# EAGLE schematic SCH1001-001-009-320 - ALU (EAGLE 9.4.2)

## Sheet 1 of 4
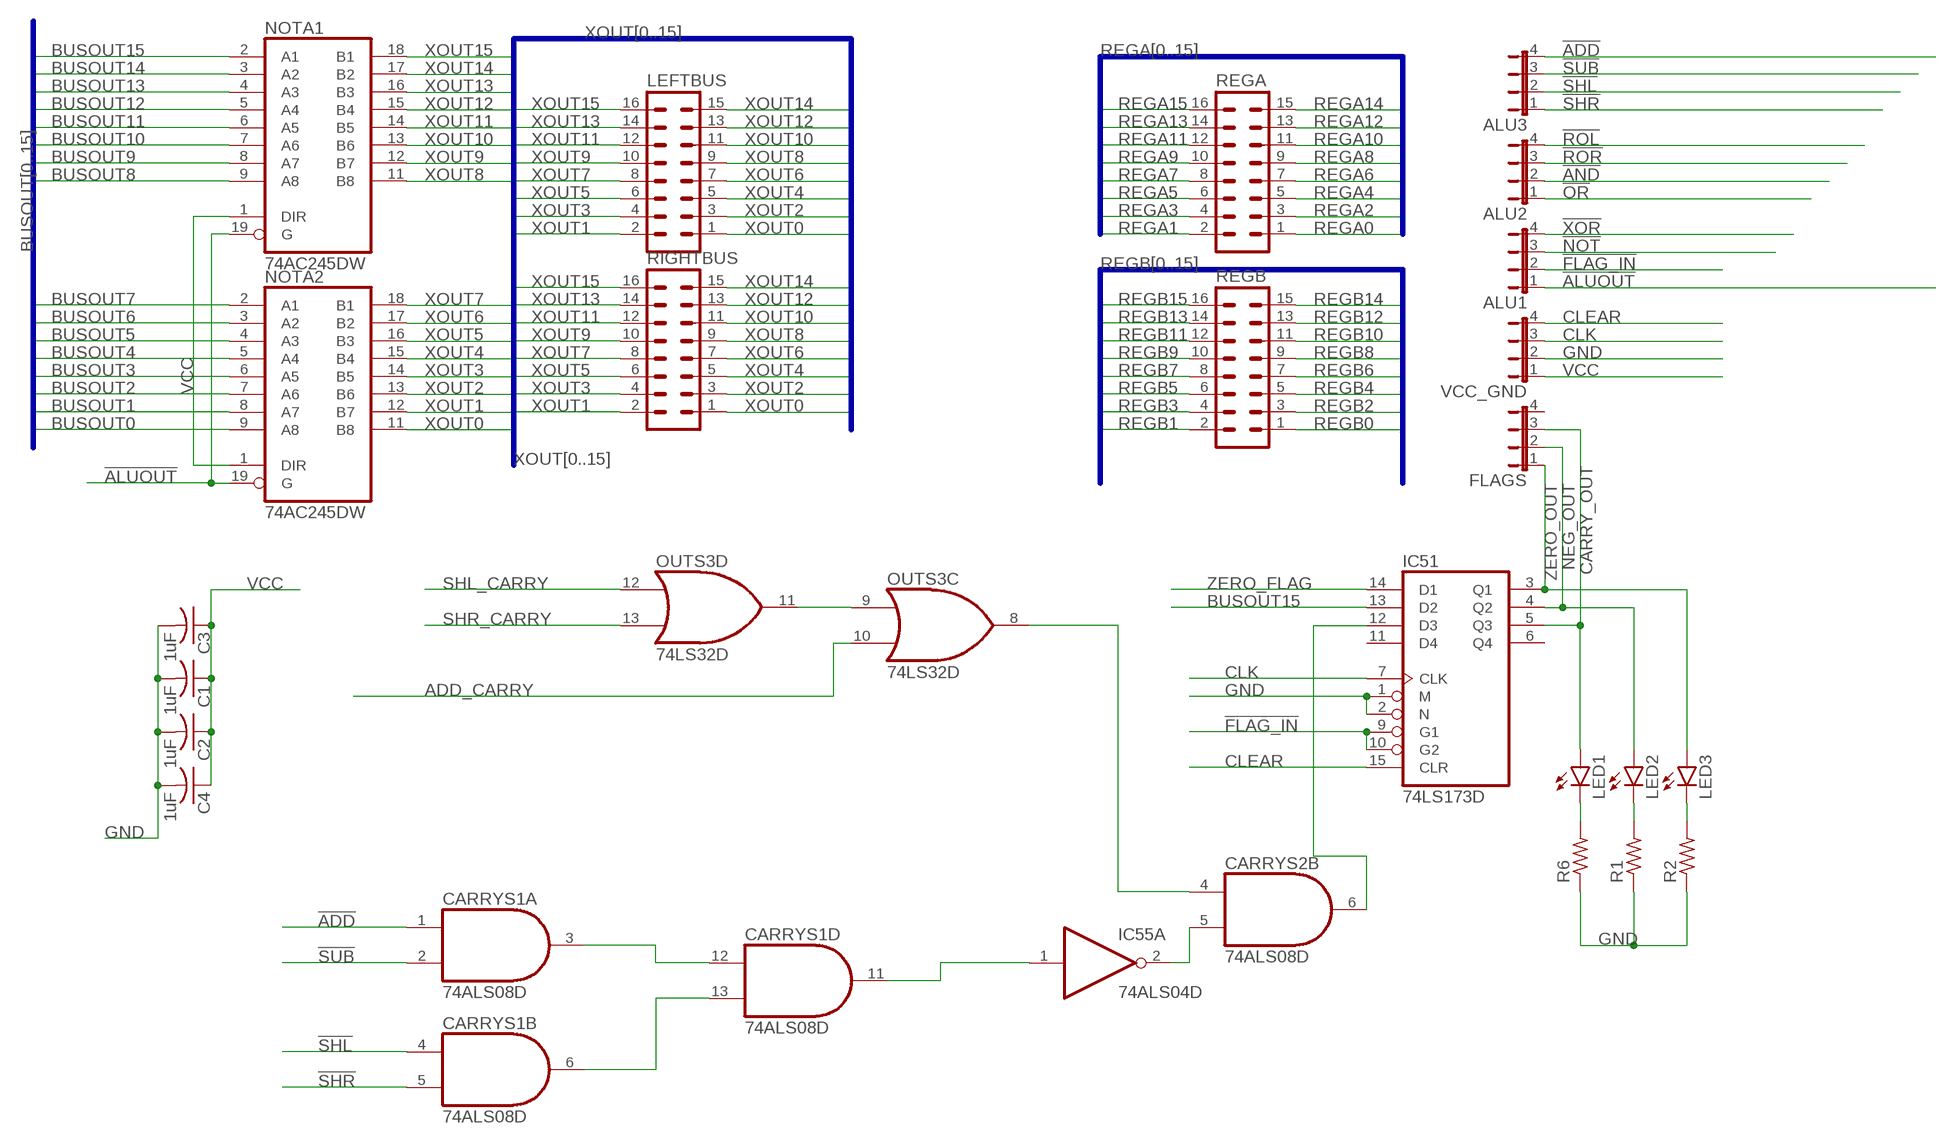
[diagram p0: schematic, sheet 1]

### Parts
ALU1  JP4E  [JP4]
ALU2  JP4E  [JP4]
ALU3  JP4E  [JP4]
C1  1uF  C-USC1206  [C1206]
C2  1uF  C-USC1206  [C1206]
C3  1uF  C-USC1206  [C1206]
C4  1uF  C-USC1206  [C1206]
CARRYS1  74ALS08D  [SO14]
CARRYS2  74ALS08D  [SO14]
FLAGS  JP4E  [JP4]
IC51  74LS173D  [SO16]
IC55  74ALS04D  [SO14]
LED1  LED5MM  [LED5MM]
LED2  LED5MM  [LED5MM]
LED3  LED5MM  [LED5MM]
LEFTBUS  ML16  [ML16]
NOTA1  74AC245DW  [SO20W]
NOTA2  74AC245DW  [SO20W]
OUTS3  74LS32D  [SO14]
R1  R-US_M1206  [M1206]
R2  R-US_M1206  [M1206]
R6  R-US_M1206  [M1206]
REGA  ML16  [ML16]
REGB  ML16  [ML16]
RIGHTBUS  ML16  [ML16]
VCC_GND  JP4E  [JP4]

### Nets
!ADD: ALU3.4 CARRYS1.1(A:I0) ; also sheet 4
!ALUOUT: ALU1.1 NOTA1.19(G) NOTA2.19(G)
!AND: ALU2.2 ; also sheet 3
!FLAG_IN: ALU1.2 IC51.9(G1) IC51.10(G2)
!NOT: ALU1.3 ; also sheet 2
!OR: ALU2.1 ; also sheet 3
!ROL: ALU2.4
!ROR: ALU2.3
!SHL: ALU3.2 CARRYS1.4(B:I0) ; also sheet 2
!SHR: ALU3.1 CARRYS1.5(B:I1) ; also sheet 2
!SUB: ALU3.3 CARRYS1.2(A:I1) ; also sheet 4
!XOR: ALU1.4 ; also sheet 3
ADD_CARRY: OUTS3.10(C:I1) ; also sheet 4
BUSOUT0: NOTA2.9(A8) ; also sheet 2,3,4
BUSOUT1: NOTA2.8(A7) ; also sheet 2,3,4
BUSOUT2: NOTA2.7(A6) ; also sheet 2,3,4
BUSOUT3: NOTA2.6(A5) ; also sheet 2,3,4
BUSOUT4: NOTA2.5(A4) ; also sheet 2,3,4
BUSOUT5: NOTA2.4(A3) ; also sheet 2,3,4
BUSOUT6: NOTA2.3(A2) ; also sheet 2,3,4
BUSOUT7: NOTA2.2(A1) ; also sheet 2,3,4
BUSOUT8: NOTA1.9(A8) ; also sheet 2,3,4
BUSOUT9: NOTA1.8(A7) ; also sheet 2,3,4
BUSOUT10: NOTA1.7(A6) ; also sheet 2,3,4
BUSOUT11: NOTA1.6(A5) ; also sheet 2,3,4
BUSOUT12: NOTA1.5(A4) ; also sheet 2,3,4
BUSOUT13: NOTA1.4(A3) ; also sheet 2,3,4
BUSOUT14: NOTA1.3(A2) ; also sheet 2,3,4
BUSOUT15: IC51.13(D2) NOTA1.2(A1) ; also sheet 2,3,4
CARRY_OUT: FLAGS.3 IC51.5(Q3) LED1.A
CLEAR: IC51.15(CLR) VCC_GND.4
CLK: IC51.7(CLK) VCC_GND.3
GND [power]: C1.2 C2.2 C3.2 C4.2 IC51.1(M) IC51.2(N) R1.1 R2.1 R6.1 VCC_GND.2
N$115: OUTS3.9(C:I0) OUTS3.11(D:O)
N$118: CARRYS2.4(B:I0) OUTS3.8(C:O)
N$131: CARRYS2.6(B:O) IC51.12(D3)
N$132: CARRYS2.5(B:I1) IC55.2(A:O)
N$134: CARRYS1.11(D:O) IC55.1(A:I)
N$135: CARRYS1.3(A:O) CARRYS1.12(D:I0)
N$136: CARRYS1.6(B:O) CARRYS1.13(D:I1)
N$138: LED1.K(C) R6.2
N$139: LED2.K(C) R1.2
N$140: LED3.K(C) R2.2
NEG_OUT: FLAGS.2 IC51.4(Q2) LED2.A
REGA0: REGA.1 ; also sheet 2,3,4
REGA1: REGA.2 ; also sheet 2,3,4
REGA2: REGA.3 ; also sheet 2,3,4
REGA3: REGA.4 ; also sheet 2,3,4
REGA4: REGA.5 ; also sheet 2,3,4
REGA5: REGA.6 ; also sheet 2,3,4
REGA6: REGA.7 ; also sheet 2,3,4
REGA7: REGA.8 ; also sheet 2,3,4
REGA8: REGA.9 ; also sheet 2,3,4
REGA9: REGA.10 ; also sheet 2,3,4
REGA10: REGA.11 ; also sheet 2,3,4
REGA11: REGA.12 ; also sheet 2,3,4
REGA12: REGA.13 ; also sheet 2,3,4
REGA13: REGA.14 ; also sheet 2,3,4
REGA14: REGA.15 ; also sheet 2,3,4
REGA15: REGA.16 ; also sheet 2,3,4
REGB0: REGB.1 ; also sheet 3,4
REGB1: REGB.2 ; also sheet 3,4
REGB2: REGB.3 ; also sheet 3,4
REGB3: REGB.4 ; also sheet 3,4
REGB4: REGB.5 ; also sheet 3,4
REGB5: REGB.6 ; also sheet 3,4
REGB6: REGB.7 ; also sheet 3,4
REGB7: REGB.8 ; also sheet 3,4
REGB8: REGB.9 ; also sheet 3,4
REGB9: REGB.10 ; also sheet 3,4
REGB10: REGB.11 ; also sheet 3,4
REGB11: REGB.12 ; also sheet 3,4
REGB12: REGB.13 ; also sheet 3,4
REGB13: REGB.14 ; also sheet 3,4
REGB14: REGB.15 ; also sheet 3,4
REGB15: REGB.16 ; also sheet 3,4
SHL_CARRY: OUTS3.12(D:I0) ; also sheet 2
SHR_CARRY: OUTS3.13(D:I1) ; also sheet 2
VCC [power]: C1.1 C2.1 C3.1 C4.1 NOTA1.1(DIR) NOTA2.1(DIR) VCC_GND.1 ; also sheet 2,3,4
XOUT0: LEFTBUS.1 NOTA2.11(B8) RIGHTBUS.1
XOUT1: LEFTBUS.2 NOTA2.12(B7) RIGHTBUS.2
XOUT2: LEFTBUS.3 NOTA2.13(B6) RIGHTBUS.3
XOUT3: LEFTBUS.4 NOTA2.14(B5) RIGHTBUS.4
XOUT4: LEFTBUS.5 NOTA2.15(B4) RIGHTBUS.5
XOUT5: LEFTBUS.6 NOTA2.16(B3) RIGHTBUS.6
XOUT6: LEFTBUS.7 NOTA2.17(B2) RIGHTBUS.7
XOUT7: LEFTBUS.8 NOTA2.18(B1) RIGHTBUS.8
XOUT8: LEFTBUS.9 NOTA1.11(B8) RIGHTBUS.9
XOUT9: LEFTBUS.10 NOTA1.12(B7) RIGHTBUS.10
XOUT10: LEFTBUS.11 NOTA1.13(B6) RIGHTBUS.11
XOUT11: LEFTBUS.12 NOTA1.14(B5) RIGHTBUS.12
XOUT12: LEFTBUS.13 NOTA1.15(B4) RIGHTBUS.13
XOUT13: LEFTBUS.14 NOTA1.16(B3) RIGHTBUS.14
XOUT14: LEFTBUS.15 NOTA1.17(B2) RIGHTBUS.15
XOUT15: LEFTBUS.16 NOTA1.18(B1) RIGHTBUS.16
ZERO_FLAG: IC51.14(D1) ; also sheet 4
ZERO_OUT: FLAGS.1 IC51.3(Q1) LED3.A
Unconnected: CARRYS1.8(C:O) CARRYS1.9(C:I0) CARRYS1.10(C:I1) CARRYS2.1(A:I0) CARRYS2.2(A:I1) CARRYS2.3(A:O) CARRYS2.8(C:O) CARRYS2.9(C:I0) CARRYS2.10(C:I1) CARRYS2.11(D:O) CARRYS2.12(D:I0) CARRYS2.13(D:I1) FLAGS.4 IC51.6(Q4) IC51.11(D4) IC55.3(B:I) IC55.4(B:O) IC55.5(C:I) IC55.6(C:O) IC55.8(D:O) IC55.9(D:I) IC55.10(E:O) IC55.11(E:I) IC55.12(F:O) IC55.13(F:I) OUTS3.1(A:I0) OUTS3.2(A:I1) OUTS3.3(A:O) OUTS3.4(B:I0) OUTS3.5(B:I1) OUTS3.6(B:O)

### Buses
REGB[0..15]
REGA[0..15]
XOUT[0..15]
BUSOUT[0..15]

## Sheet 2 of 4
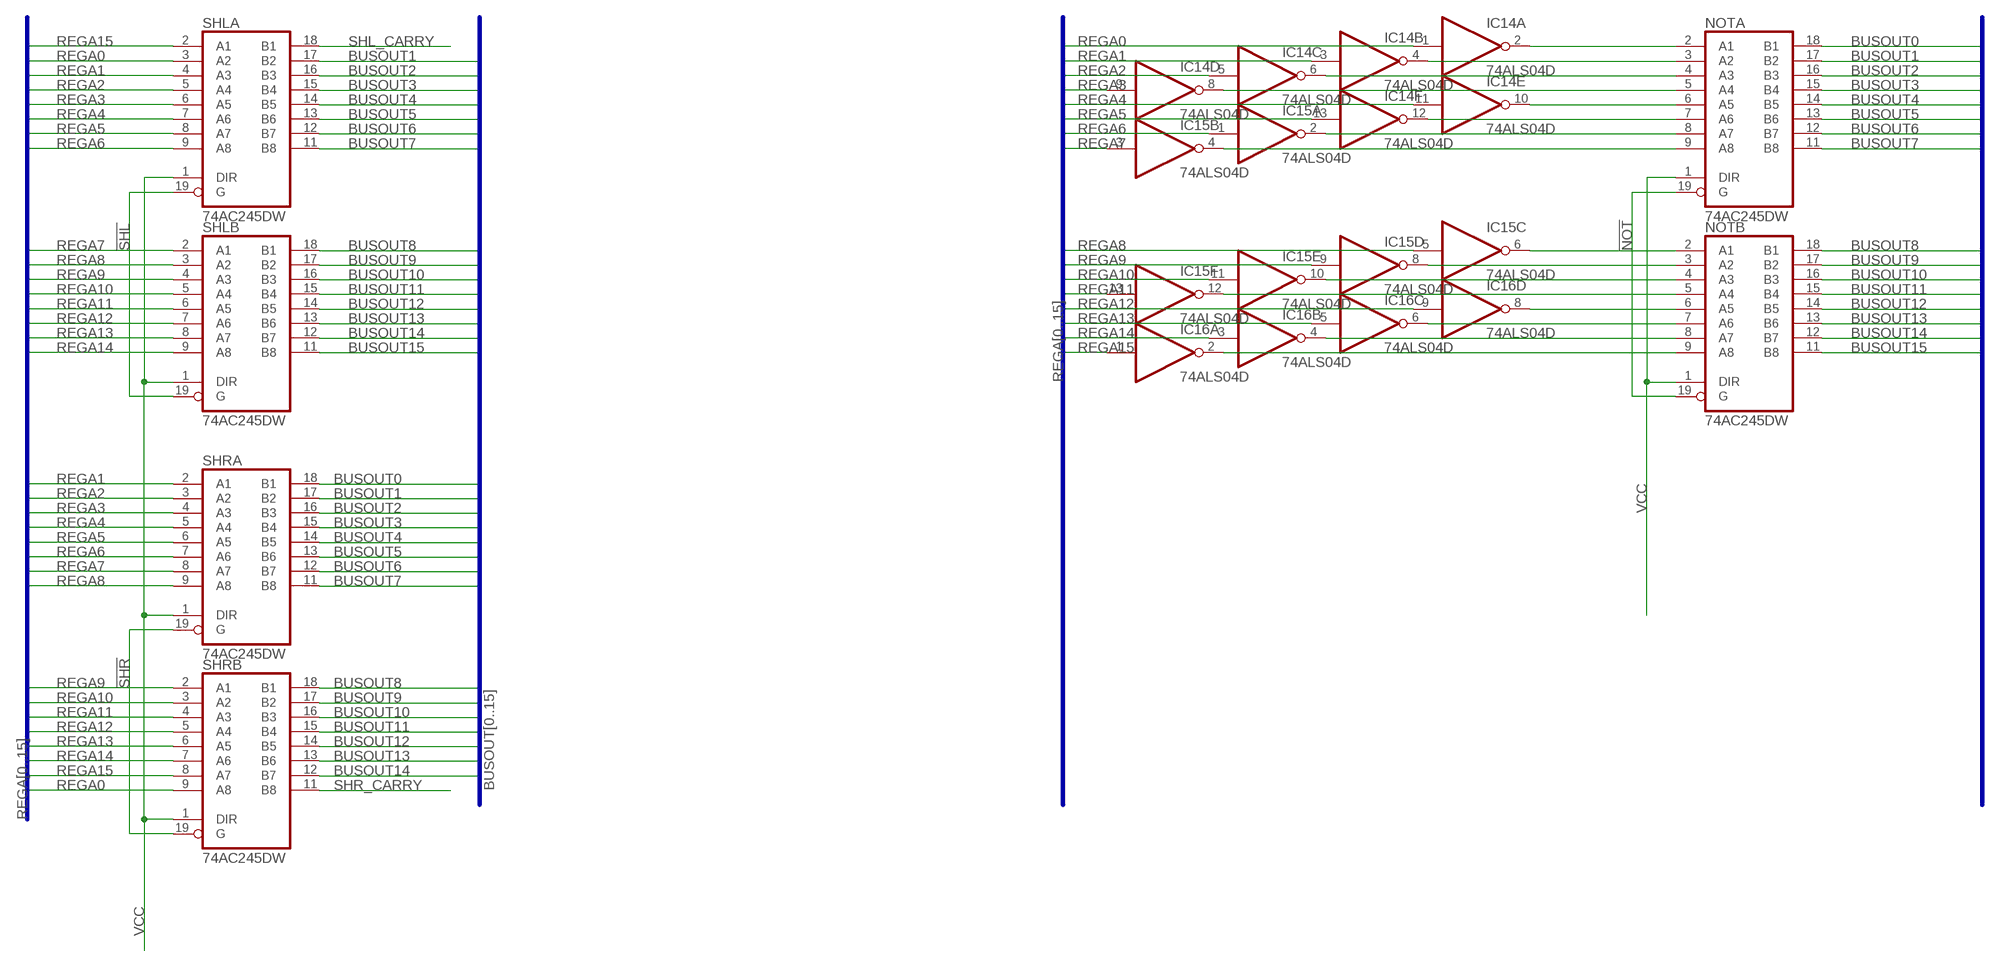
[diagram p1: schematic, sheet 2]

### Parts
IC14  74ALS04D  [SO14]
IC15  74ALS04D  [SO14]
IC16  74ALS04D  [SO14]
NOTA  74AC245DW  [SO20W]
NOTB  74AC245DW  [SO20W]
SHLA  74AC245DW  [SO20W]
SHLB  74AC245DW  [SO20W]
SHRA  74AC245DW  [SO20W]
SHRB  74AC245DW  [SO20W]

### Nets
!NOT: NOTA.19(G) NOTB.19(G) ; also sheet 1
!SHL: SHLA.19(G) SHLB.19(G) ; also sheet 1
!SHR: SHRA.19(G) SHRB.19(G) ; also sheet 1
BUSOUT0: NOTA.18(B1) SHRA.18(B1) ; also sheet 1,3,4
BUSOUT1: NOTA.17(B2) SHLA.17(B2) SHRA.17(B2) ; also sheet 1,3,4
BUSOUT2: NOTA.16(B3) SHLA.16(B3) SHRA.16(B3) ; also sheet 1,3,4
BUSOUT3: NOTA.15(B4) SHLA.15(B4) SHRA.15(B4) ; also sheet 1,3,4
BUSOUT4: NOTA.14(B5) SHLA.14(B5) SHRA.14(B5) ; also sheet 1,3,4
BUSOUT5: NOTA.13(B6) SHLA.13(B6) SHRA.13(B6) ; also sheet 1,3,4
BUSOUT6: NOTA.12(B7) SHLA.12(B7) SHRA.12(B7) ; also sheet 1,3,4
BUSOUT7: NOTA.11(B8) SHLA.11(B8) SHRA.11(B8) ; also sheet 1,3,4
BUSOUT8: NOTB.18(B1) SHLB.18(B1) SHRB.18(B1) ; also sheet 1,3,4
BUSOUT9: NOTB.17(B2) SHLB.17(B2) SHRB.17(B2) ; also sheet 1,3,4
BUSOUT10: NOTB.16(B3) SHLB.16(B3) SHRB.16(B3) ; also sheet 1,3,4
BUSOUT11: NOTB.15(B4) SHLB.15(B4) SHRB.15(B4) ; also sheet 1,3,4
BUSOUT12: NOTB.14(B5) SHLB.14(B5) SHRB.14(B5) ; also sheet 1,3,4
BUSOUT13: NOTB.13(B6) SHLB.13(B6) SHRB.13(B6) ; also sheet 1,3,4
BUSOUT14: NOTB.12(B7) SHLB.12(B7) SHRB.12(B7) ; also sheet 1,3,4
BUSOUT15: NOTB.11(B8) SHLB.11(B8) ; also sheet 1,3,4
N$1: IC14.2(A:O) NOTA.2(A1)
N$2: IC14.10(E:O) NOTA.6(A5)
N$3: IC14.4(B:O) NOTA.3(A2)
N$4: IC14.12(F:O) NOTA.7(A6)
N$5: IC15.2(A:O) NOTA.8(A7)
N$6: IC14.6(C:O) NOTA.4(A3)
N$7: IC14.8(D:O) NOTA.5(A4)
N$8: IC15.4(B:O) NOTA.9(A8)
N$9: IC15.6(C:O) NOTB.2(A1)
N$10: IC16.8(D:O) NOTB.6(A5)
N$11: IC15.8(D:O) NOTB.3(A2)
N$12: IC16.6(C:O) NOTB.7(A6)
N$13: IC16.4(B:O) NOTB.8(A7)
N$14: IC15.10(E:O) NOTB.4(A3)
N$15: IC15.12(F:O) NOTB.5(A4)
N$16: IC16.2(A:O) NOTB.9(A8)
REGA0: IC14.1(A:I) SHLA.3(A2) SHRB.9(A8) ; also sheet 1,3,4
REGA1: IC14.3(B:I) SHLA.4(A3) SHRA.2(A1) ; also sheet 1,3,4
REGA2: IC14.5(C:I) SHLA.5(A4) SHRA.3(A2) ; also sheet 1,3,4
REGA3: IC14.9(D:I) SHLA.6(A5) SHRA.4(A3) ; also sheet 1,3,4
REGA4: IC14.11(E:I) SHLA.7(A6) SHRA.5(A4) ; also sheet 1,3,4
REGA5: IC14.13(F:I) SHLA.8(A7) SHRA.6(A5) ; also sheet 1,3,4
REGA6: IC15.1(A:I) SHLA.9(A8) SHRA.7(A6) ; also sheet 1,3,4
REGA7: IC15.3(B:I) SHLB.2(A1) SHRA.8(A7) ; also sheet 1,3,4
REGA8: IC15.5(C:I) SHLB.3(A2) SHRA.9(A8) ; also sheet 1,3,4
REGA9: IC15.9(D:I) SHLB.4(A3) SHRB.2(A1) ; also sheet 1,3,4
REGA10: IC15.11(E:I) SHLB.5(A4) SHRB.3(A2) ; also sheet 1,3,4
REGA11: IC15.13(F:I) SHLB.6(A5) SHRB.4(A3) ; also sheet 1,3,4
REGA12: IC16.9(D:I) SHLB.7(A6) SHRB.5(A4) ; also sheet 1,3,4
REGA13: IC16.5(C:I) SHLB.8(A7) SHRB.6(A5) ; also sheet 1,3,4
REGA14: IC16.3(B:I) SHLB.9(A8) SHRB.7(A6) ; also sheet 1,3,4
REGA15: IC16.1(A:I) SHLA.2(A1) SHRB.8(A7) ; also sheet 1,3,4
SHL_CARRY: SHLA.18(B1) ; also sheet 1
SHR_CARRY: SHRB.11(B8) ; also sheet 1
VCC [power]: NOTA.1(DIR) NOTB.1(DIR) SHLA.1(DIR) SHLB.1(DIR) SHRA.1(DIR) SHRB.1(DIR) ; also sheet 1,3,4
Unconnected: IC16.10(E:O) IC16.11(E:I) IC16.12(F:O) IC16.13(F:I)

### Buses
REGA[0..15]
BUSOUT[0..15]

## Sheet 3 of 4
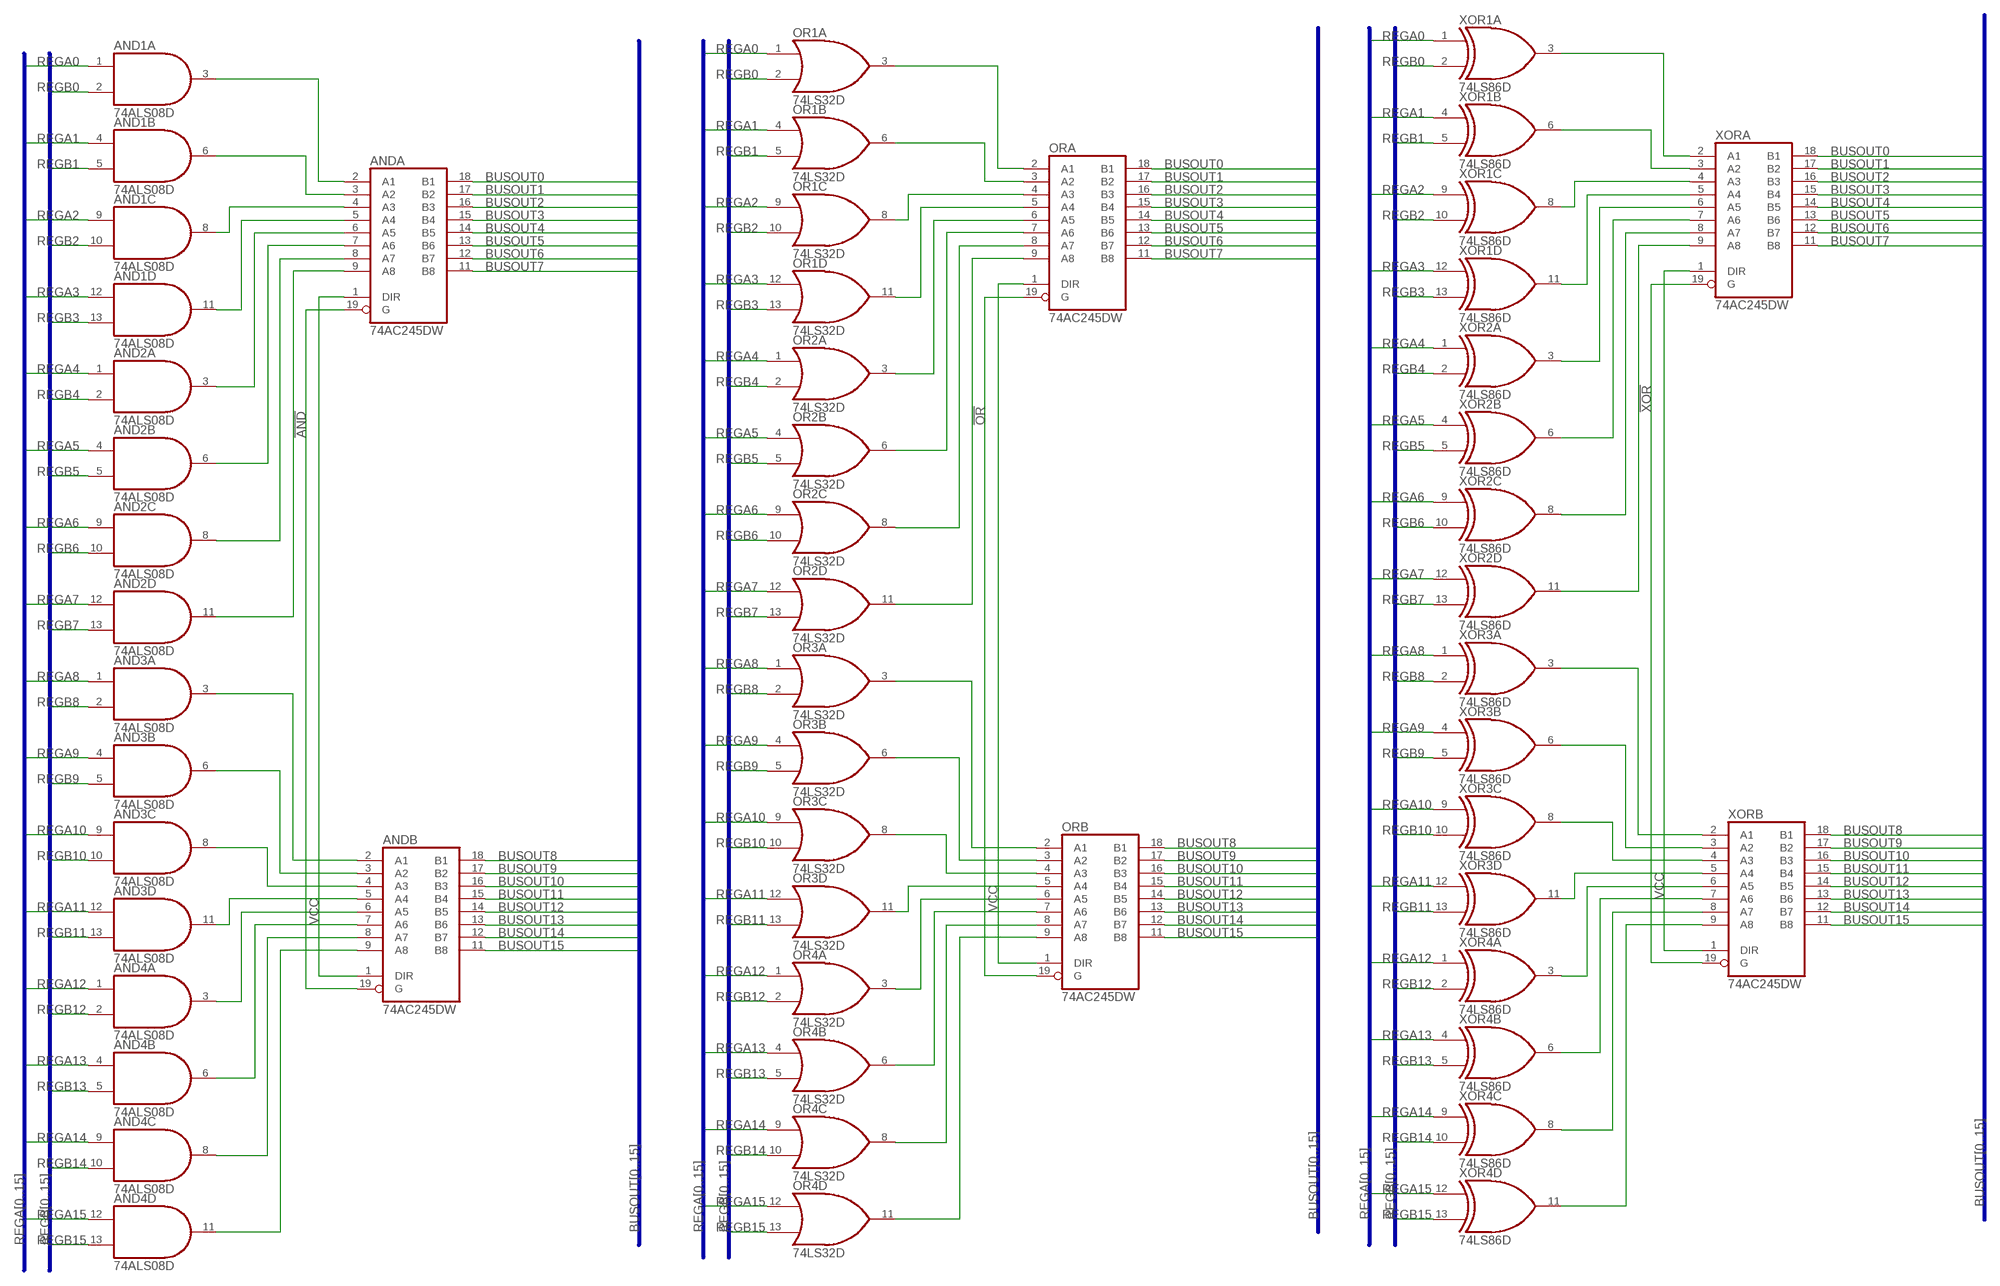
[diagram p2: schematic, sheet 3]

### Parts
AND1  74ALS08D  [SO14]
AND2  74ALS08D  [SO14]
AND3  74ALS08D  [SO14]
AND4  74ALS08D  [SO14]
ANDA  74AC245DW  [SO20W]
ANDB  74AC245DW  [SO20W]
OR1  74LS32D  [SO14]
OR2  74LS32D  [SO14]
OR3  74LS32D  [SO14]
OR4  74LS32D  [SO14]
ORA  74AC245DW  [SO20W]
ORB  74AC245DW  [SO20W]
XOR1  74LS86D  [SO14]
XOR2  74LS86D  [SO14]
XOR3  74LS86D  [SO14]
XOR4  74LS86D  [SO14]
XORA  74AC245DW  [SO20W]
XORB  74AC245DW  [SO20W]

### Nets
!AND: ANDA.19(G) ANDB.19(G) ; also sheet 1
!OR: ORA.19(G) ORB.19(G) ; also sheet 1
!XOR: XORA.19(G) XORB.19(G) ; also sheet 1
BUSOUT0: ANDA.18(B1) ORA.18(B1) XORA.18(B1) ; also sheet 1,2,4
BUSOUT1: ANDA.17(B2) ORA.17(B2) XORA.17(B2) ; also sheet 1,2,4
BUSOUT2: ANDA.16(B3) ORA.16(B3) XORA.16(B3) ; also sheet 1,2,4
BUSOUT3: ANDA.15(B4) ORA.15(B4) XORA.15(B4) ; also sheet 1,2,4
BUSOUT4: ANDA.14(B5) ORA.14(B5) XORA.14(B5) ; also sheet 1,2,4
BUSOUT5: ANDA.13(B6) ORA.13(B6) XORA.13(B6) ; also sheet 1,2,4
BUSOUT6: ANDA.12(B7) ORA.12(B7) XORA.12(B7) ; also sheet 1,2,4
BUSOUT7: ANDA.11(B8) ORA.11(B8) XORA.11(B8) ; also sheet 1,2,4
BUSOUT8: ANDB.18(B1) ORB.18(B1) XORB.18(B1) ; also sheet 1,2,4
BUSOUT9: ANDB.17(B2) ORB.17(B2) XORB.17(B2) ; also sheet 1,2,4
BUSOUT10: ANDB.16(B3) ORB.16(B3) XORB.16(B3) ; also sheet 1,2,4
BUSOUT11: ANDB.15(B4) ORB.15(B4) XORB.15(B4) ; also sheet 1,2,4
BUSOUT12: ANDB.14(B5) ORB.14(B5) XORB.14(B5) ; also sheet 1,2,4
BUSOUT13: ANDB.13(B6) ORB.13(B6) XORB.13(B6) ; also sheet 1,2,4
BUSOUT14: ANDB.12(B7) ORB.12(B7) XORB.12(B7) ; also sheet 1,2,4
BUSOUT15: ANDB.11(B8) ORB.11(B8) XORB.11(B8) ; also sheet 1,2,4
N$17: AND1.3(A:O) ANDA.2(A1)
N$18: AND1.6(B:O) ANDA.3(A2)
N$19: AND1.8(C:O) ANDA.4(A3)
N$20: AND1.11(D:O) ANDA.5(A4)
N$21: AND2.3(A:O) ANDA.6(A5)
N$22: AND2.6(B:O) ANDA.7(A6)
N$23: AND2.8(C:O) ANDA.8(A7)
N$24: AND2.11(D:O) ANDA.9(A8)
N$25: AND3.3(A:O) ANDB.2(A1)
N$26: AND3.6(B:O) ANDB.3(A2)
N$27: AND3.8(C:O) ANDB.4(A3)
N$28: AND3.11(D:O) ANDB.5(A4)
N$29: AND4.3(A:O) ANDB.6(A5)
N$30: AND4.6(B:O) ANDB.7(A6)
N$31: AND4.8(C:O) ANDB.8(A7)
N$32: AND4.11(D:O) ANDB.9(A8)
N$33: OR1.3(A:O) ORA.2(A1)
N$34: OR1.6(B:O) ORA.3(A2)
N$35: OR1.8(C:O) ORA.4(A3)
N$36: OR1.11(D:O) ORA.5(A4)
N$37: OR2.3(A:O) ORA.6(A5)
N$38: OR2.6(B:O) ORA.7(A6)
N$39: OR2.8(C:O) ORA.8(A7)
N$40: OR2.11(D:O) ORA.9(A8)
N$41: OR3.3(A:O) ORB.2(A1)
N$42: OR3.6(B:O) ORB.3(A2)
N$43: OR3.8(C:O) ORB.4(A3)
N$44: OR3.11(D:O) ORB.5(A4)
N$45: OR4.3(A:O) ORB.6(A5)
N$46: OR4.6(B:O) ORB.7(A6)
N$47: OR4.8(C:O) ORB.8(A7)
N$48: OR4.11(D:O) ORB.9(A8)
N$49: XOR1.3(A:O) XORA.2(A1)
N$50: XOR1.6(B:O) XORA.3(A2)
N$51: XOR1.8(C:O) XORA.4(A3)
N$52: XOR1.11(D:O) XORA.5(A4)
N$53: XOR2.3(A:O) XORA.6(A5)
N$54: XOR2.6(B:O) XORA.7(A6)
N$55: XOR2.8(C:O) XORA.8(A7)
N$56: XOR2.11(D:O) XORA.9(A8)
N$57: XOR3.3(A:O) XORB.2(A1)
N$58: XOR3.6(B:O) XORB.3(A2)
N$59: XOR3.8(C:O) XORB.4(A3)
N$60: XOR3.11(D:O) XORB.5(A4)
N$61: XOR4.3(A:O) XORB.6(A5)
N$62: XOR4.6(B:O) XORB.7(A6)
N$63: XOR4.8(C:O) XORB.8(A7)
N$64: XOR4.11(D:O) XORB.9(A8)
REGA0: AND1.1(A:I0) OR1.1(A:I0) XOR1.1(A:I0) ; also sheet 1,2,4
REGA1: AND1.4(B:I0) OR1.4(B:I0) XOR1.4(B:I0) ; also sheet 1,2,4
REGA2: AND1.9(C:I0) OR1.9(C:I0) XOR1.9(C:I0) ; also sheet 1,2,4
REGA3: AND1.12(D:I0) OR1.12(D:I0) XOR1.12(D:I0) ; also sheet 1,2,4
REGA4: AND2.1(A:I0) OR2.1(A:I0) XOR2.1(A:I0) ; also sheet 1,2,4
REGA5: AND2.4(B:I0) OR2.4(B:I0) XOR2.4(B:I0) ; also sheet 1,2,4
REGA6: AND2.9(C:I0) OR2.9(C:I0) XOR2.9(C:I0) ; also sheet 1,2,4
REGA7: AND2.12(D:I0) OR2.12(D:I0) XOR2.12(D:I0) ; also sheet 1,2,4
REGA8: AND3.1(A:I0) OR3.1(A:I0) XOR3.1(A:I0) ; also sheet 1,2,4
REGA9: AND3.4(B:I0) OR3.4(B:I0) XOR3.4(B:I0) ; also sheet 1,2,4
REGA10: AND3.9(C:I0) OR3.9(C:I0) XOR3.9(C:I0) ; also sheet 1,2,4
REGA11: AND3.12(D:I0) OR3.12(D:I0) XOR3.12(D:I0) ; also sheet 1,2,4
REGA12: AND4.1(A:I0) OR4.1(A:I0) XOR4.1(A:I0) ; also sheet 1,2,4
REGA13: AND4.4(B:I0) OR4.4(B:I0) XOR4.4(B:I0) ; also sheet 1,2,4
REGA14: AND4.9(C:I0) OR4.9(C:I0) XOR4.9(C:I0) ; also sheet 1,2,4
REGA15: AND4.12(D:I0) OR4.12(D:I0) XOR4.12(D:I0) ; also sheet 1,2,4
REGB0: AND1.2(A:I1) OR1.2(A:I1) XOR1.2(A:I1) ; also sheet 1,4
REGB1: AND1.5(B:I1) OR1.5(B:I1) XOR1.5(B:I1) ; also sheet 1,4
REGB2: AND1.10(C:I1) OR1.10(C:I1) XOR1.10(C:I1) ; also sheet 1,4
REGB3: AND1.13(D:I1) OR1.13(D:I1) XOR1.13(D:I1) ; also sheet 1,4
REGB4: AND2.2(A:I1) OR2.2(A:I1) XOR2.2(A:I1) ; also sheet 1,4
REGB5: AND2.5(B:I1) OR2.5(B:I1) XOR2.5(B:I1) ; also sheet 1,4
REGB6: AND2.10(C:I1) OR2.10(C:I1) XOR2.10(C:I1) ; also sheet 1,4
REGB7: AND2.13(D:I1) OR2.13(D:I1) XOR2.13(D:I1) ; also sheet 1,4
REGB8: AND3.2(A:I1) OR3.2(A:I1) XOR3.2(A:I1) ; also sheet 1,4
REGB9: AND3.5(B:I1) OR3.5(B:I1) XOR3.5(B:I1) ; also sheet 1,4
REGB10: AND3.10(C:I1) OR3.10(C:I1) XOR3.10(C:I1) ; also sheet 1,4
REGB11: AND3.13(D:I1) OR3.13(D:I1) XOR3.13(D:I1) ; also sheet 1,4
REGB12: AND4.2(A:I1) OR4.2(A:I1) XOR4.2(A:I1) ; also sheet 1,4
REGB13: AND4.5(B:I1) OR4.5(B:I1) XOR4.5(B:I1) ; also sheet 1,4
REGB14: AND4.10(C:I1) OR4.10(C:I1) XOR4.10(C:I1) ; also sheet 1,4
REGB15: AND4.13(D:I1) OR4.13(D:I1) XOR4.13(D:I1) ; also sheet 1,4
VCC [power]: ANDA.1(DIR) ANDB.1(DIR) ORA.1(DIR) ORB.1(DIR) XORA.1(DIR) XORB.1(DIR) ; also sheet 1,2,4

### Buses
REGA[0..15]
REGB[0..15]
BUSOUT[0..15]

## Sheet 4 of 4
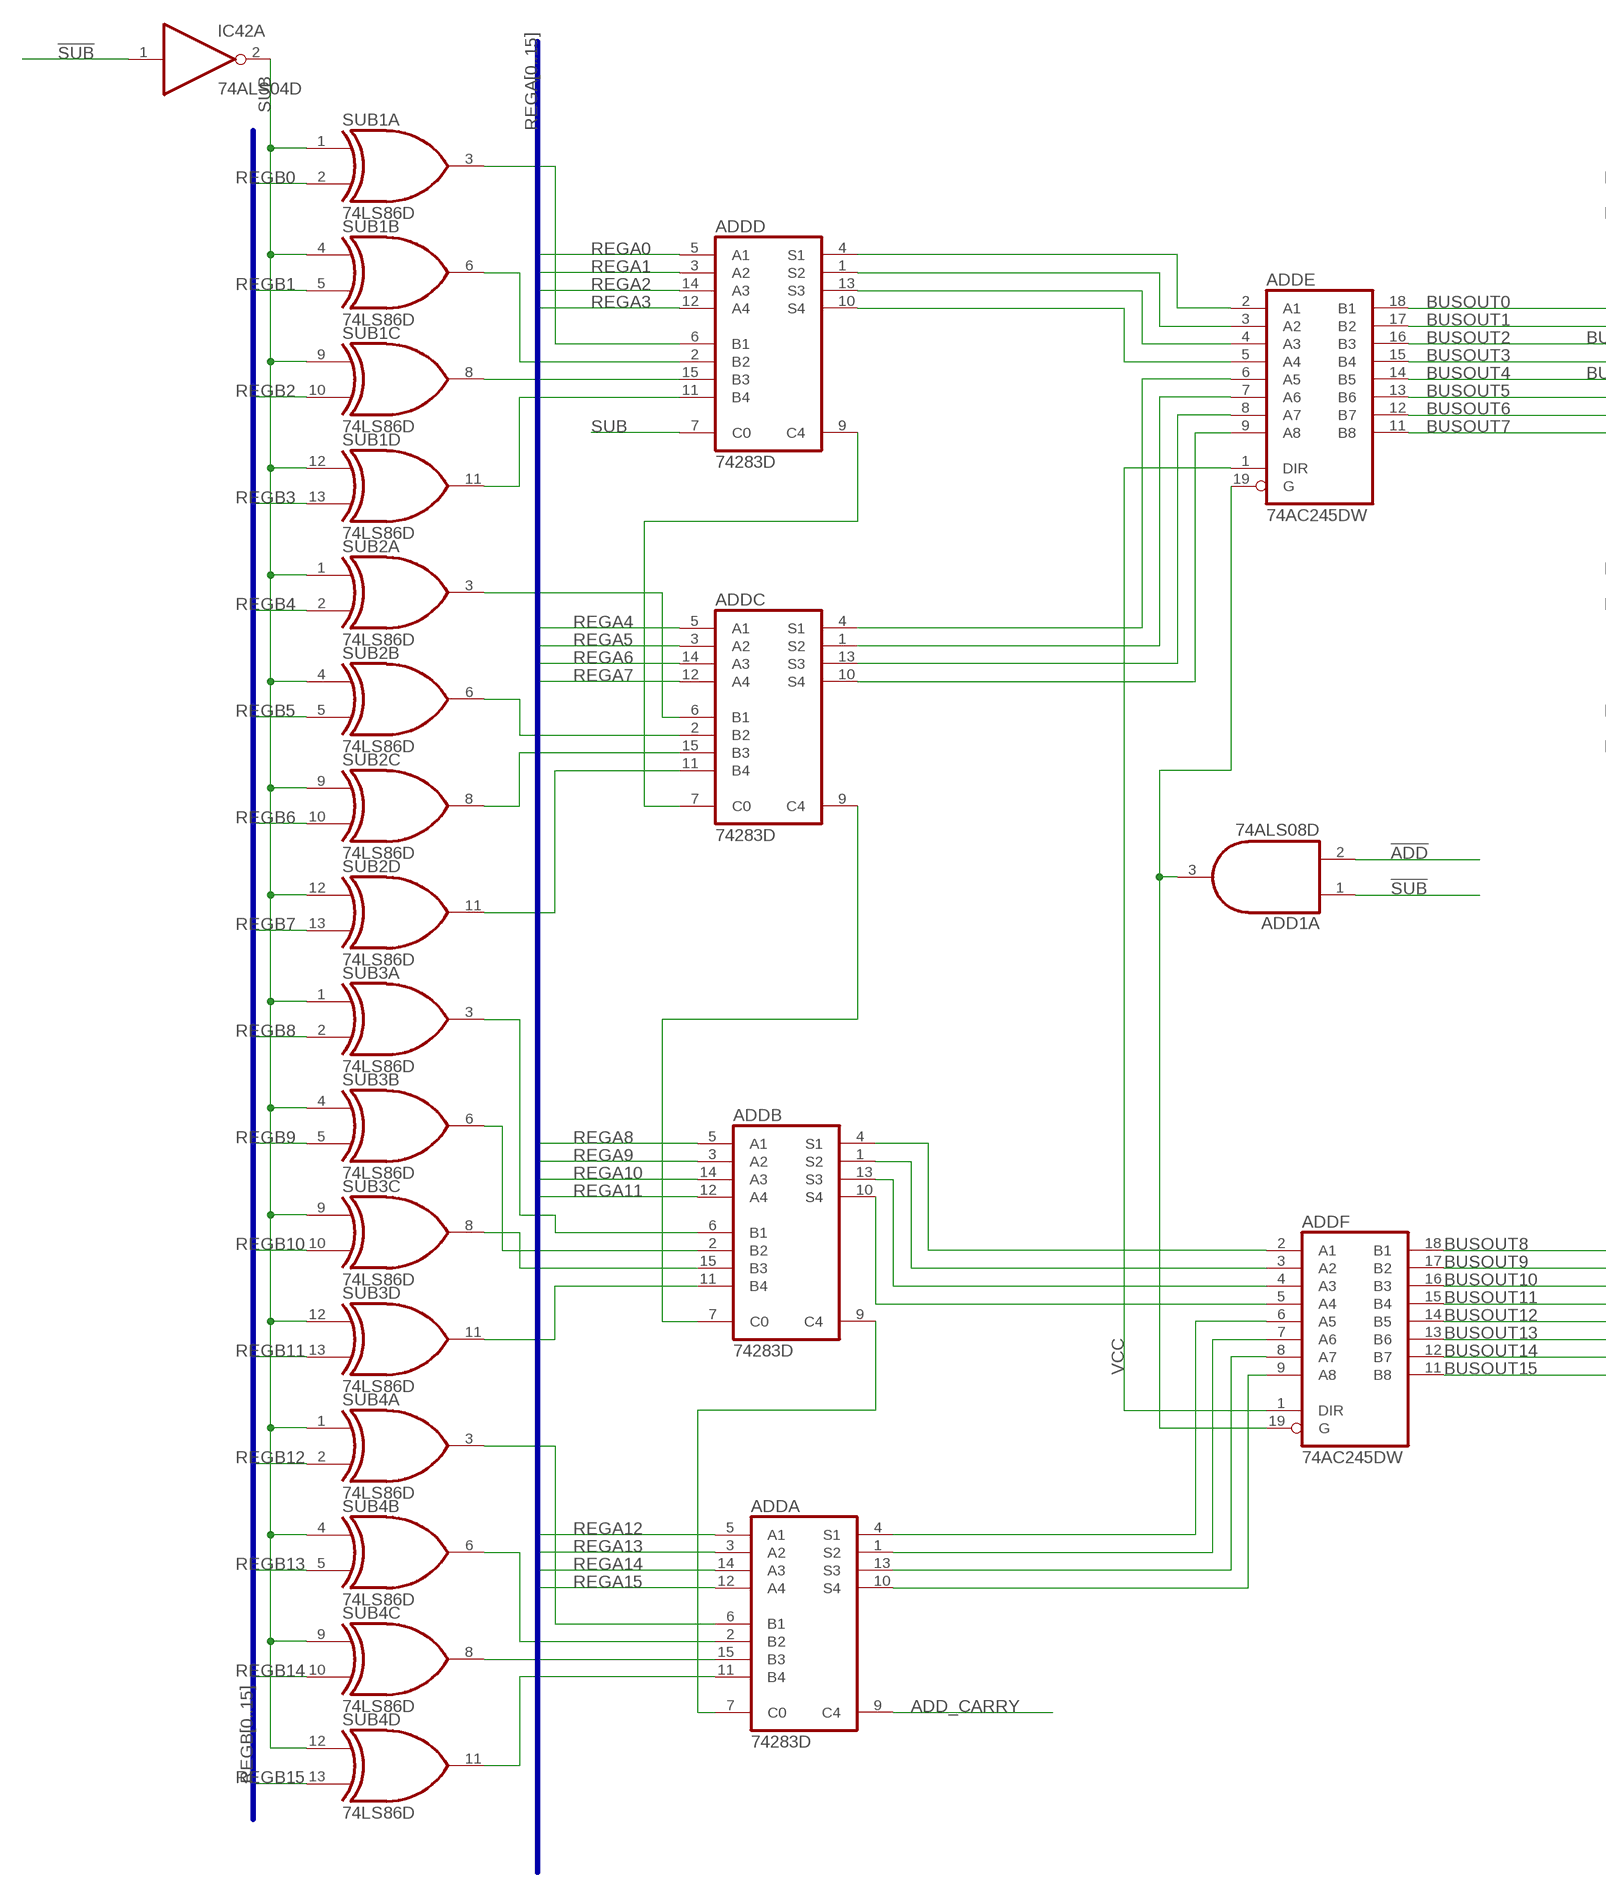
[diagram p3: schematic, sheet 4, part 1 of 2]
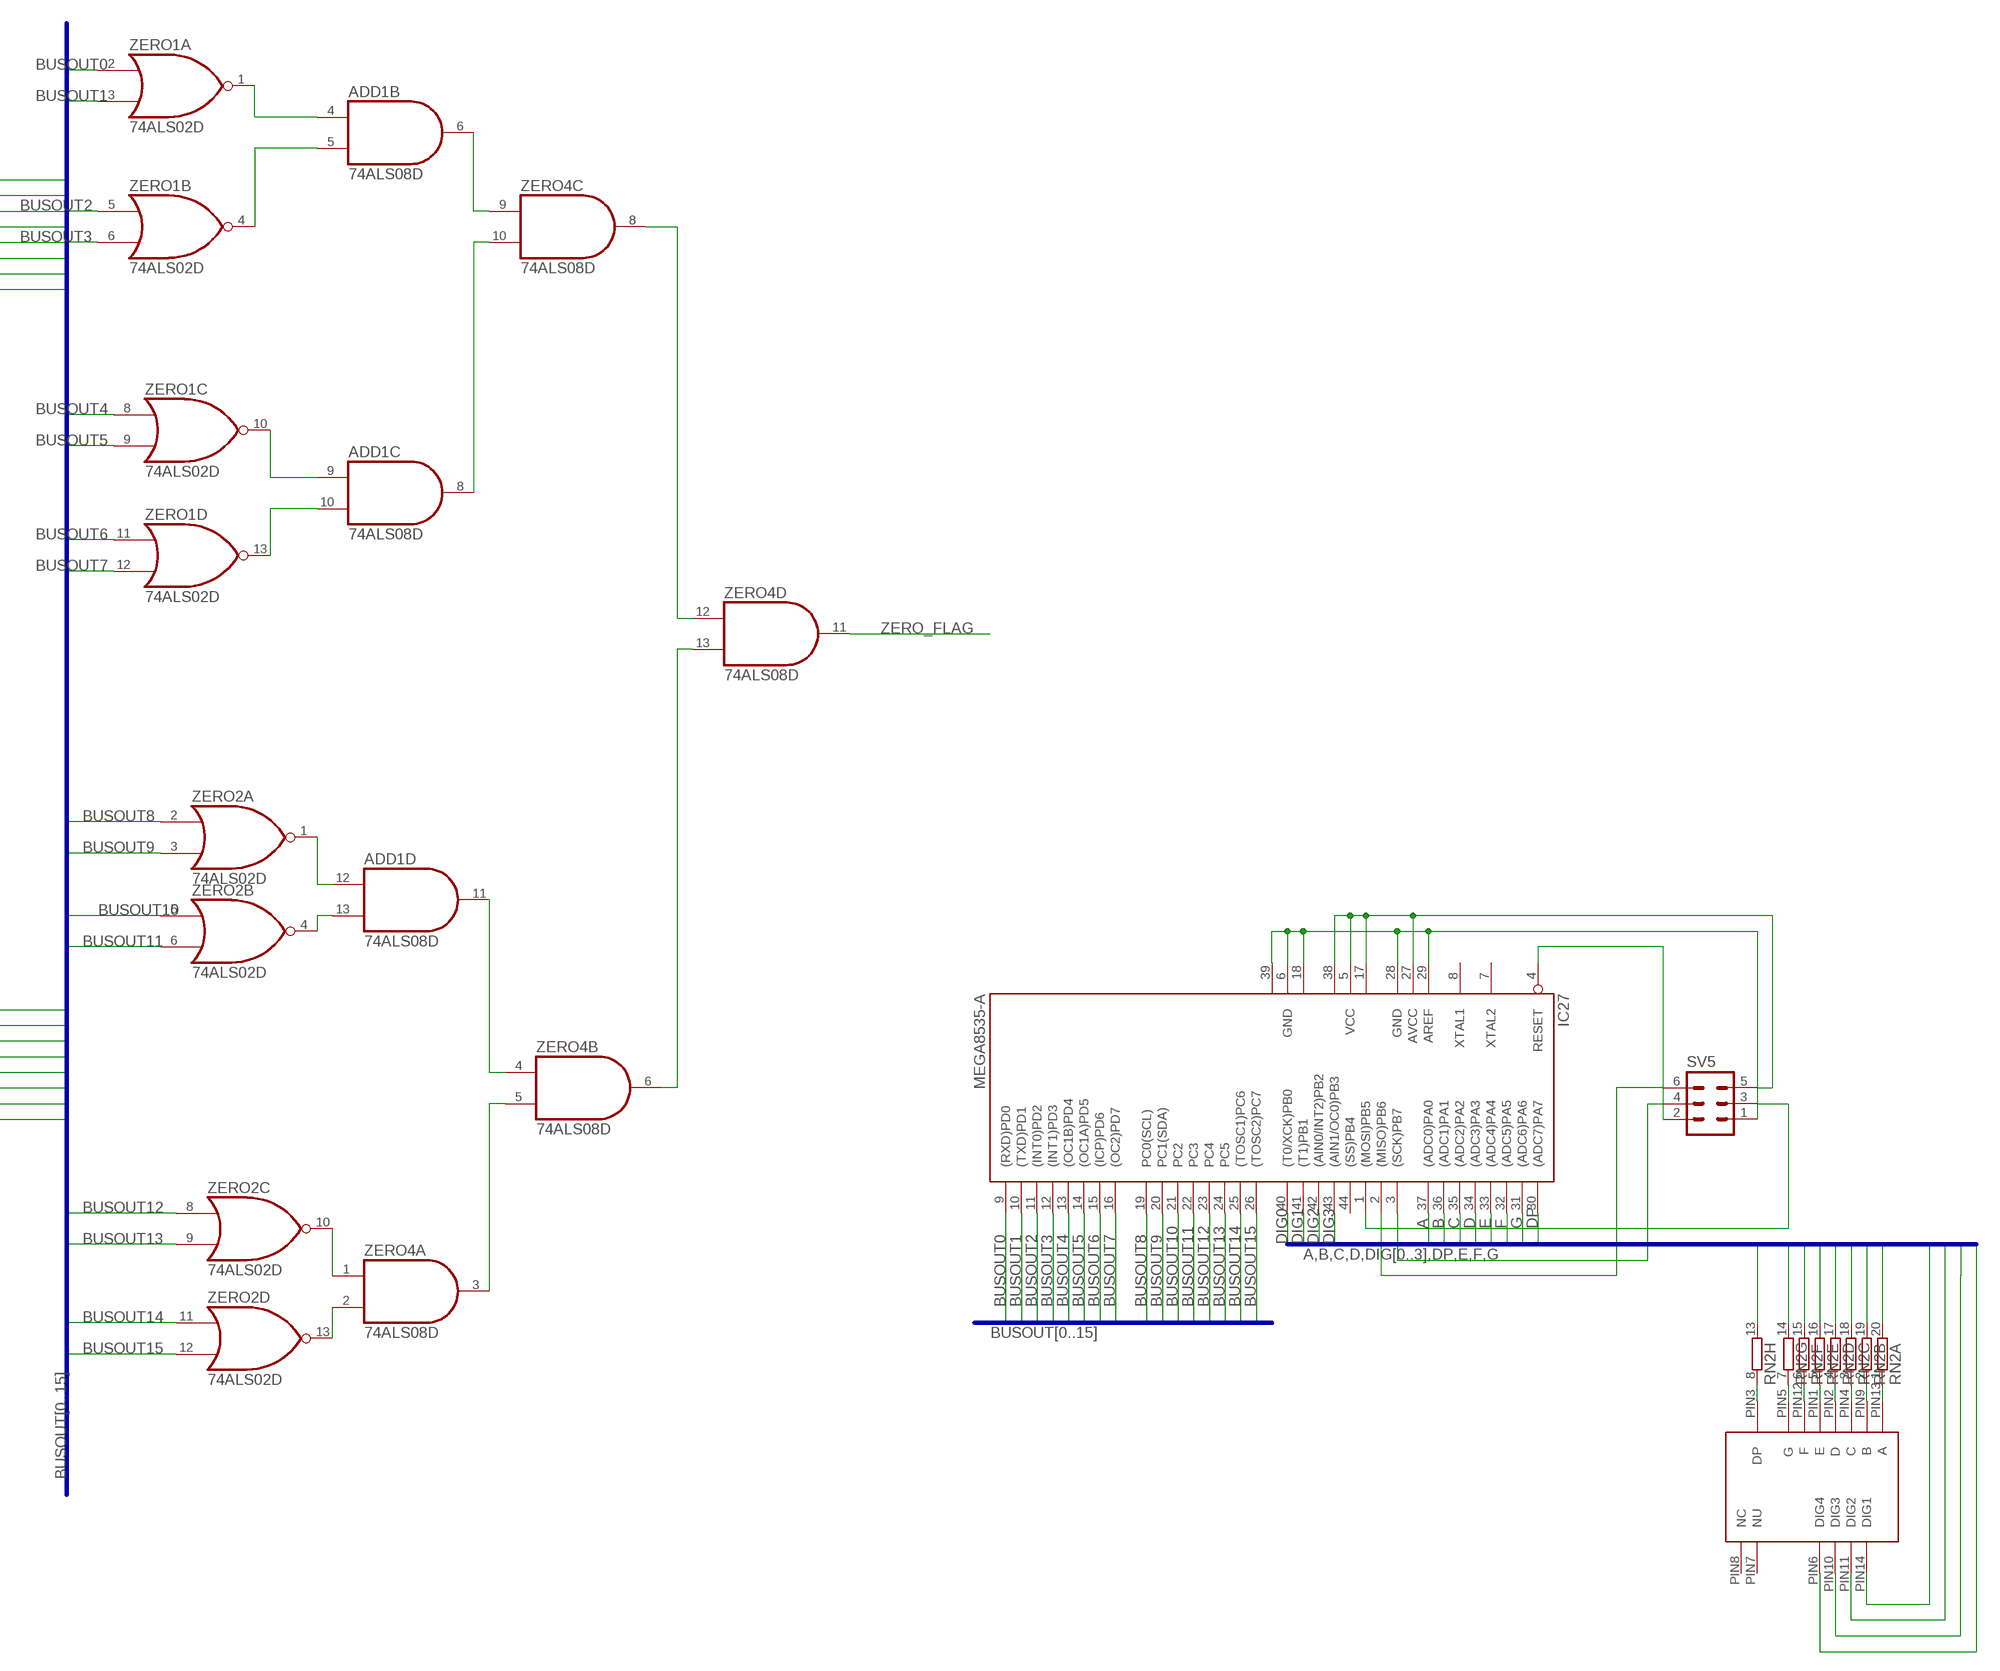
[diagram p4: schematic, sheet 4, part 2 of 2]

### Parts
ADD1  74ALS08D  [SO14]
ADDA  74283D  [SO16]
ADDB  74283D  [SO16]
ADDC  74283D  [SO16]
ADDD  74283D  [SO16]
ADDE  74AC245DW  [SO20W]
ADDF  74AC245DW  [SO20W]
IC27  MEGA8535-A  [TQFP44]
IC42  74ALS04D  [SO14]
RN2  10R-NSOMC  [SOMC20]
SUB1  74LS86D  [SO14]
SUB2  74LS86D  [SO14]
SUB3  74LS86D  [SO14]
SUB4  74LS86D  [SO14]
SV5  ML6  [ML6]
U$1  4-DIGIT-7-SEGMENT  [4-DIGIT-7-SEGMENT]
ZERO1  74ALS02D  [SO14]
ZERO2  74ALS02D  [SO14]
ZERO4  74ALS08D  [SO14]

### Nets
!ADD: ADD1.2(A:I1) ; also sheet 1
!SUB: ADD1.1(A:I0) IC42.1(A:I) ; also sheet 1
A: IC27.37((ADC0)PA0) RN2.20
ADD_CARRY: ADDA.9(C4) ; also sheet 1
B: IC27.36((ADC1)PA1) RN2.19
BUSOUT0: ADDE.18(B1) IC27.9((RXD)PD0) ZERO1.2(A:I0) ; also sheet 1,2,3
BUSOUT1: ADDE.17(B2) IC27.10((TXD)PD1) ZERO1.3(A:I1) ; also sheet 1,2,3
BUSOUT2: ADDE.16(B3) IC27.11((INT0)PD2) ZERO1.5(B:I0) ; also sheet 1,2,3
BUSOUT3: ADDE.15(B4) IC27.12((INT1)PD3) ZERO1.6(B:I1) ; also sheet 1,2,3
BUSOUT4: ADDE.14(B5) IC27.13((OC1B)PD4) ZERO1.8(C:I0) ; also sheet 1,2,3
BUSOUT5: ADDE.13(B6) IC27.14((OC1A)PD5) ZERO1.9(C:I1) ; also sheet 1,2,3
BUSOUT6: ADDE.12(B7) IC27.15((ICP)PD6) ZERO1.11(D:I0) ; also sheet 1,2,3
BUSOUT7: ADDE.11(B8) IC27.16((OC2)PD7) ZERO1.12(D:I1) ; also sheet 1,2,3
BUSOUT8: ADDF.18(B1) IC27.19(PC0(SCL)) ZERO2.2(A:I0) ; also sheet 1,2,3
BUSOUT9: ADDF.17(B2) IC27.20(PC1(SDA)) ZERO2.3(A:I1) ; also sheet 1,2,3
BUSOUT10: ADDF.16(B3) IC27.21(PC2) ZERO2.5(B:I0) ; also sheet 1,2,3
BUSOUT11: ADDF.15(B4) IC27.22(PC3) ZERO2.6(B:I1) ; also sheet 1,2,3
BUSOUT12: ADDF.14(B5) IC27.23(PC4) ZERO2.8(C:I0) ; also sheet 1,2,3
BUSOUT13: ADDF.13(B6) IC27.24(PC5) ZERO2.9(C:I1) ; also sheet 1,2,3
BUSOUT14: ADDF.12(B7) IC27.25((TOSC1)PC6) ZERO2.11(D:I0) ; also sheet 1,2,3
BUSOUT15: ADDF.11(B8) IC27.26((TOSC2)PC7) ZERO2.12(D:I1) ; also sheet 1,2,3
C: IC27.35((ADC2)PA2) RN2.18
D: IC27.34((ADC3)PA3) RN2.17
DIG0: IC27.40((T0/XCK)PB0) U$1.PIN14(DIG1)
DIG1: IC27.41((T1)PB1) U$1.PIN11(DIG2)
DIG2: IC27.42((AIN0/INT2)PB2) U$1.PIN10(DIG3)
DIG3: IC27.43((AIN1/OC0)PB3) U$1.PIN6(DIG4)
DP: IC27.30((ADC7)PA7) RN2.13
E: IC27.33((ADC4)PA4) RN2.16
F: IC27.32((ADC5)PA5) RN2.15
G: IC27.31((ADC6)PA6) RN2.14
N$65: ADDD.6(B1) SUB1.3(A:O)
N$66: ADDD.2(B2) SUB1.6(B:O)
N$67: ADDD.15(B3) SUB1.8(C:O)
N$68: ADDD.11(B4) SUB1.11(D:O)
N$69: ADDD.4(S1) ADDE.2(A1)
N$70: ADDD.1(S2) ADDE.3(A2)
N$73: ADDC.10(S4) ADDE.9(A8)
N$74: ADDC.13(S3) ADDE.8(A7)
N$75: ADDC.1(S2) ADDE.7(A6)
N$76: ADDC.4(S1) ADDE.6(A5)
N$77: ADDC.6(B1) SUB2.3(A:O)
N$78: ADDC.2(B2) SUB2.6(B:O)
N$79: ADDC.15(B3) SUB2.8(C:O)
N$80: ADDC.11(B4) SUB2.11(D:O)
N$81: ADDC.7(C0) ADDD.9(C4)
N$82: ADDA.2(B2) SUB4.6(B:O)
N$83: ADDA.15(B3) SUB4.8(C:O)
N$84: ADDA.11(B4) SUB4.11(D:O)
N$85: ADDA.6(B1) SUB4.3(A:O)
N$86: ADDA.7(C0) ADDB.9(C4)
N$87: ADDA.10(S4) ADDF.9(A8)
N$88: ADDA.13(S3) ADDF.8(A7)
N$89: ADDA.1(S2) ADDF.7(A6)
N$90: ADDA.4(S1) ADDF.6(A5)
N$91: ADDB.11(B4) SUB3.11(D:O)
N$92: ADDB.15(B3) SUB3.8(C:O)
N$93: ADDB.2(B2) SUB3.6(B:O)
N$94: ADDB.6(B1) SUB3.3(A:O)
N$95: ADDB.7(C0) ADDC.9(C4)
N$96: ADDB.10(S4) ADDF.5(A4)
N$97: ADDB.13(S3) ADDF.4(A3)
N$98: ADDB.1(S2) ADDF.3(A2)
N$99: ADDB.4(S1) ADDF.2(A1)
N$100: ADD1.3(A:O) ADDE.19(G) ADDF.19(G)
N$101: ADD1.4(B:I0) ZERO1.1(A:O)
N$102: ADD1.5(B:I1) ZERO1.4(B:O)
N$103: ADD1.9(C:I0) ZERO1.10(C:O)
N$104: ADD1.10(C:I1) ZERO1.13(D:O)
N$105: ADD1.8(C:O) ZERO4.10(C:I1)
N$106: ADD1.6(B:O) ZERO4.9(C:I0)
N$107: ZERO4.8(C:O) ZERO4.12(D:I0)
N$108: ZERO4.6(B:O) ZERO4.13(D:I1)
N$109: ADD1.11(D:O) ZERO4.4(B:I0)
N$110: ZERO4.3(A:O) ZERO4.5(B:I1)
N$111: ZERO2.10(C:O) ZERO4.1(A:I0)
N$112: ZERO2.13(D:O) ZERO4.2(A:I1)
N$113: ADD1.12(D:I0) ZERO2.1(A:O)
N$114: ADD1.13(D:I1) ZERO2.4(B:O)
N$116: ADDD.13(S3) ADDE.4(A3)
N$117: ADDD.10(S4) ADDE.5(A4)
N$120: IC27.1((MOSI)PB5) SV5.3
N$121: IC27.3((SCK)PB7) SV5.4
N$122: IC27.2((MISO)PB6) SV5.6
N$123: IC27.4(RESET) SV5.2
N$124: RN2.1 U$1.PIN13(A)
N$125: RN2.2 U$1.PIN9(B)
N$126: RN2.3 U$1.PIN4(C)
N$127: RN2.4 U$1.PIN2(D)
N$128: RN2.5 U$1.PIN1(E)
N$129: RN2.6 U$1.PIN12(F)
N$130: RN2.7 U$1.PIN5(G)
N$141: RN2.8 U$1.PIN3(DP)
N$142: IC27.5(VCC) IC27.17(VCC1) IC27.27(AVCC) IC27.38(VCC2) SV5.5
N$143: IC27.6(GND) IC27.18(GND1) IC27.28(GND) IC27.29(AREF) IC27.39(GND2) SV5.1
REGA0: ADDD.5(A1) ; also sheet 1,2,3
REGA1: ADDD.3(A2) ; also sheet 1,2,3
REGA2: ADDD.14(A3) ; also sheet 1,2,3
REGA3: ADDD.12(A4) ; also sheet 1,2,3
REGA4: ADDC.5(A1) ; also sheet 1,2,3
REGA5: ADDC.3(A2) ; also sheet 1,2,3
REGA6: ADDC.14(A3) ; also sheet 1,2,3
REGA7: ADDC.12(A4) ; also sheet 1,2,3
REGA8: ADDB.5(A1) ; also sheet 1,2,3
REGA9: ADDB.3(A2) ; also sheet 1,2,3
REGA10: ADDB.14(A3) ; also sheet 1,2,3
REGA11: ADDB.12(A4) ; also sheet 1,2,3
REGA12: ADDA.5(A1) ; also sheet 1,2,3
REGA13: ADDA.3(A2) ; also sheet 1,2,3
REGA14: ADDA.14(A3) ; also sheet 1,2,3
REGA15: ADDA.12(A4) ; also sheet 1,2,3
REGB0: SUB1.2(A:I1) ; also sheet 1,3
REGB1: SUB1.5(B:I1) ; also sheet 1,3
REGB2: SUB1.10(C:I1) ; also sheet 1,3
REGB3: SUB1.13(D:I1) ; also sheet 1,3
REGB4: SUB2.2(A:I1) ; also sheet 1,3
REGB5: SUB2.5(B:I1) ; also sheet 1,3
REGB6: SUB2.10(C:I1) ; also sheet 1,3
REGB7: SUB2.13(D:I1) ; also sheet 1,3
REGB8: SUB3.2(A:I1) ; also sheet 1,3
REGB9: SUB3.5(B:I1) ; also sheet 1,3
REGB10: SUB3.10(C:I1) ; also sheet 1,3
REGB11: SUB3.13(D:I1) ; also sheet 1,3
REGB12: SUB4.2(A:I1) ; also sheet 1,3
REGB13: SUB4.5(B:I1) ; also sheet 1,3
REGB14: SUB4.10(C:I1) ; also sheet 1,3
REGB15: SUB4.13(D:I1) ; also sheet 1,3
SUB: ADDD.7(C0) IC42.2(A:O) SUB1.1(A:I0) SUB1.4(B:I0) SUB1.9(C:I0) SUB1.12(D:I0) SUB2.1(A:I0) SUB2.4(B:I0) SUB2.9(C:I0) SUB2.12(D:I0) SUB3.1(A:I0) SUB3.4(B:I0) SUB3.9(C:I0) SUB3.12(D:I0) SUB4.1(A:I0) SUB4.4(B:I0) SUB4.9(C:I0) SUB4.12(D:I0)
VCC [power]: ADDE.1(DIR) ADDF.1(DIR) ; also sheet 1,2,3
ZERO_FLAG: ZERO4.11(D:O) ; also sheet 1
Unconnected: IC27.7(XTAL2) IC27.8(XTAL1) IC27.44((SS)PB4) IC42.3(B:I) IC42.4(B:O) IC42.5(C:I) IC42.6(C:O) IC42.8(D:O) IC42.9(D:I) IC42.10(E:O) IC42.11(E:I) IC42.12(F:O) IC42.13(F:I) RN2.9 RN2.10 RN2.11 RN2.12 U$1.PIN7(NU) U$1.PIN8(NC)

### Buses
REGB[0..15]
BUSOUT[0..15]
REGA[0..15]
A,B,C,D,DIG[0..3],DP,E,F,G

## Power pins joined to a net without a drawn wire
GND: ADD1.7(P:GND) ADDA.8(GND) ADDB.8(GND) ADDC.8(GND) ADDD.8(GND) ADDE.10(GND) ADDF.10(GND) AND1.7(P:GND) AND2.7(P:GND) AND3.7(P:GND) AND4.7(P:GND) ANDA.10(GND) ANDB.10(GND) CARRYS1.7(P:GND) CARRYS2.7(P:GND) IC14.7(P:GND) IC15.7(P:GND) IC16.7(P:GND) IC42.7(P:GND) IC51.8(GND) IC55.7(P:GND) NOTA1.10(GND) NOTA2.10(GND) NOTA.10(GND) NOTB.10(GND) OR1.7(P:GND) OR2.7(P:GND) OR3.7(P:GND) OR4.7(P:GND) ORA.10(GND) ORB.10(GND) OUTS3.7(P:GND) SHLA.10(GND) SHLB.10(GND) SHRA.10(GND) SHRB.10(GND) SUB1.7(P:GND) SUB2.7(P:GND) SUB3.7(P:GND) SUB4.7(P:GND) XOR1.7(P:GND) XOR2.7(P:GND) XOR3.7(P:GND) XOR4.7(P:GND) XORA.10(GND) XORB.10(GND) ZERO1.7(P:GND) ZERO2.7(P:GND) ZERO4.7(P:GND)
VCC: ADD1.14(P:VCC) ADDA.16(VCC) ADDB.16(VCC) ADDC.16(VCC) ADDD.16(VCC) ADDE.20(VCC) ADDF.20(VCC) AND1.14(P:VCC) AND2.14(P:VCC) AND3.14(P:VCC) AND4.14(P:VCC) ANDA.20(VCC) ANDB.20(VCC) CARRYS1.14(P:VCC) CARRYS2.14(P:VCC) IC14.14(P:VCC) IC15.14(P:VCC) IC16.14(P:VCC) IC42.14(P:VCC) IC51.16(VCC) IC55.14(P:VCC) NOTA1.20(VCC) NOTA2.20(VCC) NOTA.20(VCC) NOTB.20(VCC) OR1.14(P:VCC) OR2.14(P:VCC) OR3.14(P:VCC) OR4.14(P:VCC) ORA.20(VCC) ORB.20(VCC) OUTS3.14(P:VCC) SHLA.20(VCC) SHLB.20(VCC) SHRA.20(VCC) SHRB.20(VCC) SUB1.14(P:VCC) SUB2.14(P:VCC) SUB3.14(P:VCC) SUB4.14(P:VCC) XOR1.14(P:VCC) XOR2.14(P:VCC) XOR3.14(P:VCC) XOR4.14(P:VCC) XORA.20(VCC) XORB.20(VCC) ZERO1.14(P:VCC) ZERO2.14(P:VCC) ZERO4.14(P:VCC)

## Library data of the parts
ADD1 AND1-AND4 CARRYS1 CARRYS2 ZERO4 = 74xx-us:74*08: Quad 2-input AND gate
ADDA ADDB ADDC ADDD = 74xx-us:74*283: 4-bit binary FULL ADDER, fast carry
ADDE ADDF ANDA ANDB NOTA NOTA1 NOTA2 NOTB ORA ORB SHLA SHLB SHRA SHRB XORA XORB = 74xx-eu:74*245: Octal BUS TRANSCEIVER, 3-state
ALU1-ALU3 FLAGS VCC_GND = jumper:JP4E: JUMPER
C1-C4 = rcl:C-US: CAPACITOR, American symbol; SPICEPREFIX: C
IC14-IC16 IC42 IC55 = 74xx-us:74*04: Hex INVERTER
IC27 = atmel:MEGA8535: MICROCONTROLLER 8 Kbytes FLASH 512 bytes SRAM 512 bytes EEPROM USART 8-channel 10 bit ADC Source: avr.lbr; MPN: ATMEGA8535-16AU; OC_FARNELL: 1528437; OC_NEWARK: 01M6908
IC51 = 74xx-us:74*173: 4-bit D type REGISTER, 3-state
LED1-LED3 = led:LED: LED OSRAM: - CHIPLED LG R971, LG N971, LY N971, LG Q971, LY Q971, LO R971, LY R971 LH N974, LH R974 LS Q976, LO Q976, LY Q976 LO Q996 - Hyper CHIPLED LW Q18S LB Q993, LB Q99A, LB R99A - SideLED LS A670, LO A670, LY A670, LG A670, LP A670 LB A673, LV A673, LT A673, LW A673 LH A674 LY A675 LS A676, LA A676, LO A676, LY A676, LW A676 LS A679, LY A679, LG A679 - Hyper Micro SIDELED® LS Y876, LA Y876, LO Y876, LY Y876 LT Y87S - SmartLED LW L88C, LW L88S LB L89C, LB L89S, LG L890 LS L89K, LO L89K, LY L89K LS L896, LA L896, LO L896, LY L896 - TOPLED LS T670, LO T670, LY T670, LG T670, LP T670 LSG T670, LSP T670, LSY T670, LOP T670, LYG T670 LG T671, LOG T671, LSG T671 LB T673, LV T673, LT T673, LW T673 LH T674 LS T676, LA T676, LO T676, LY T676, LB T676, LH T676, LSB T676, LW T676 LB T67C, LV T67C, LT T67C, LS T67K, LO T67K, LY T67K, LW E67C LS E67B, LA E67B, LO E67B, LY E67B, LB E67C, LV E67C, LT E67C LW T67C LS T679, LY T679, LG T679 LS T770, LO T770, LY T770, LG T770, LP T770 LB T773, LV T773, LT T773, LW T773 LH T774 LS E675, LA E675, LY E675, LS T675 LS T776, LA T776, LO T776, LY T776, LB T776 LHGB T686 LT T68C, LB T68C - Hyper Mini TOPLED® LB M676 - Mini TOPLED Santana® LG M470 LS M47K, LO M47K, LY M47K Source: http://www.osram.convergy.de LUXEON: - LUMILED® LXK2-PW12-R00, LXK2-PW12-S00, LXK2-PW14-U00, LXK2-PW14-V00 LXK2-PM12-R00, LXK2-PM12-S00, LXK2-PM14-U00 LXK2-PE12-Q00, LXK2-PE12-R00, LXK2-PE12-S00, LXK2-PE14-T00, LXK2-PE14-U00 LXK2-PB12-K00, LXK2-PB12-L00, LXK2-PB12-M00, LXK2-PB14-N00, LXK2-PB14-P00, LXK2-PB14-Q00 LXK2-PR12-L00, LXK2-PR12-M00, LXK2-PR14-Q00, LXK2-PR14-R00 LXK2-PD12-Q00, LXK2-PD12-R00, LXK2-PD12-S00 LXK2-PH12-R00, LXK2-PH12-S00 LXK2-PL12-P00, LXK2-PL12-Q00, LXK2-PL12-R00 Source: www.luxeon.com KINGBRIGHT: KA-3528ASYC Source: www.kingbright.com
LEFTBUS REGA REGB RIGHTBUS = con-harting-ml:ML16: HARTING; OC_FARNELL: unknown; OC_NEWARK: unknown
OR1-OR4 OUTS3 = 74xx-us:74*32: Quad 2-input OR gate
R1 R2 R6 = rcl:R-US_: RESISTOR, American symbol; SPICEPREFIX: R
RN2 = resistor-dil:10R-N: DIL RESISTOR; OC_FARNELL: unknown; OC_NEWARK: unknown
SUB1-SUB4 XOR1-XOR4 = 74xx-us:74*86: Quad 2-input EXCLUSIV-OR (XOR) gate
SV5 = con-harting-ml:ML6: HARTING; OC_FARNELL: unknown; OC_NEWARK: unknown
U$1 = ADAFRUIT:4-DIGIT-7-SEGMENT
ZERO1 ZERO2 = 74xx-us:74*02: Quad 2-input NOR gate

## Net classes
1 power: width 0.457 mm